# Altium project 主控A.PrjPCB
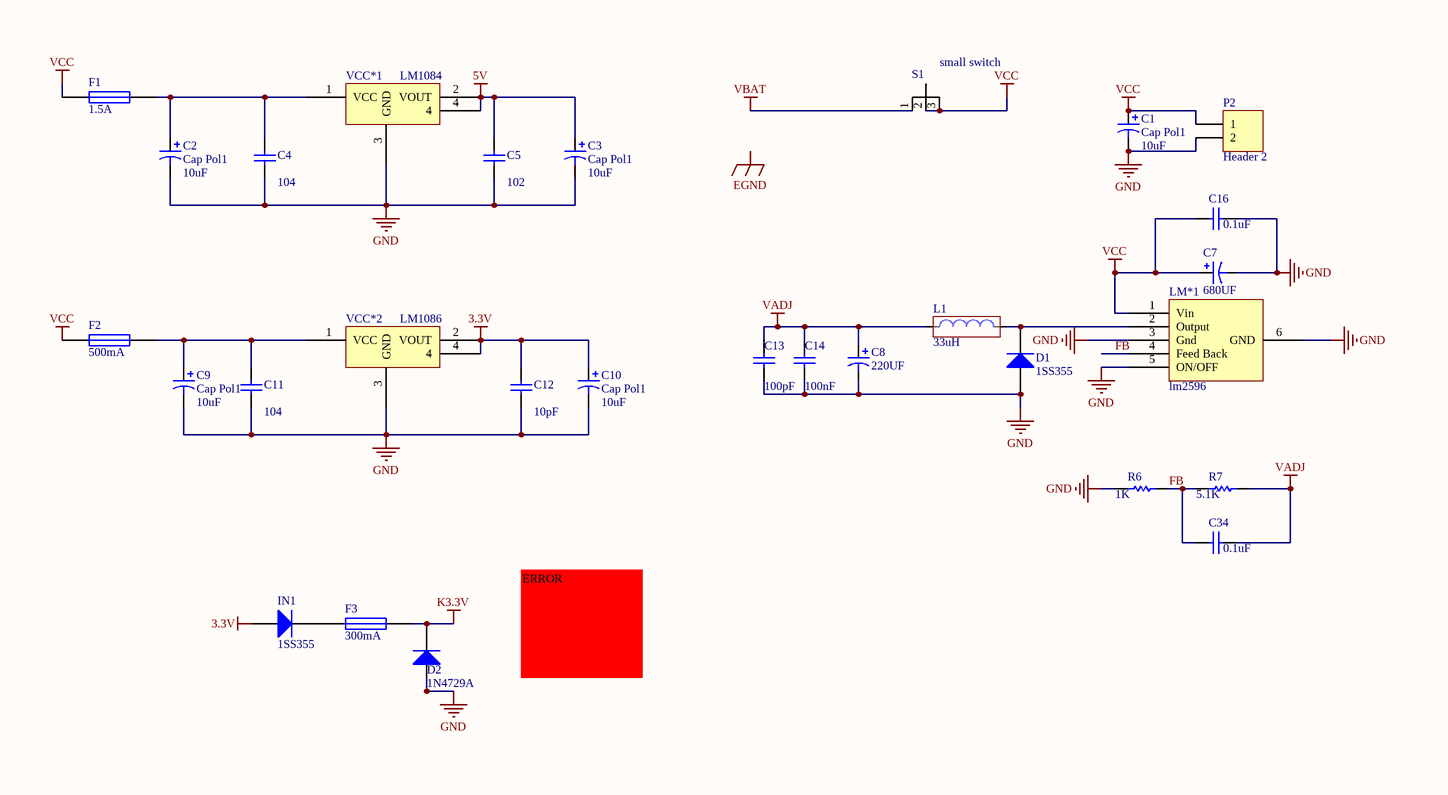
[diagram p0: 主控A.SchDoc, top left]
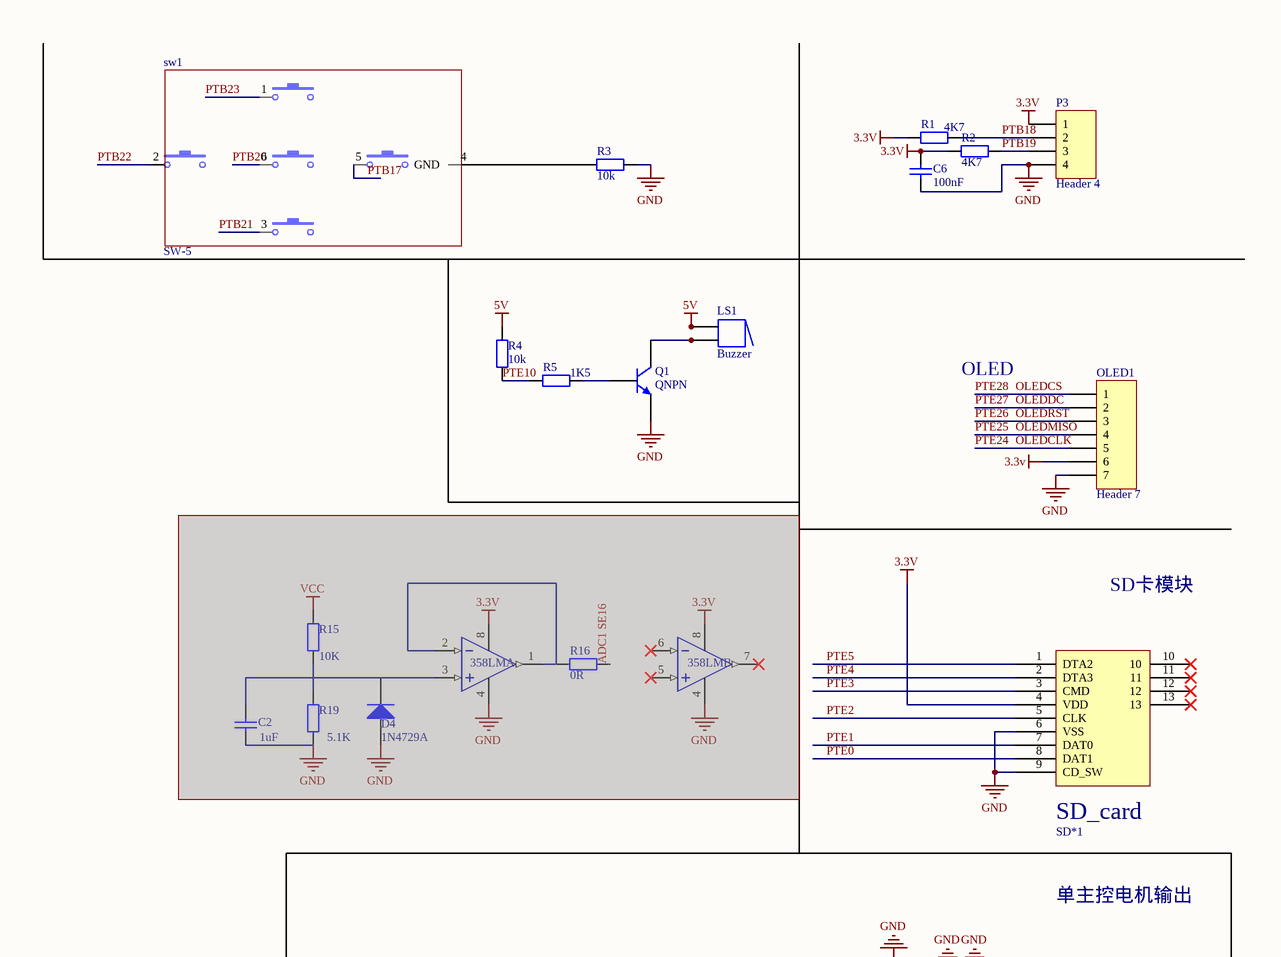
[diagram p1: 主控A.SchDoc, top right]
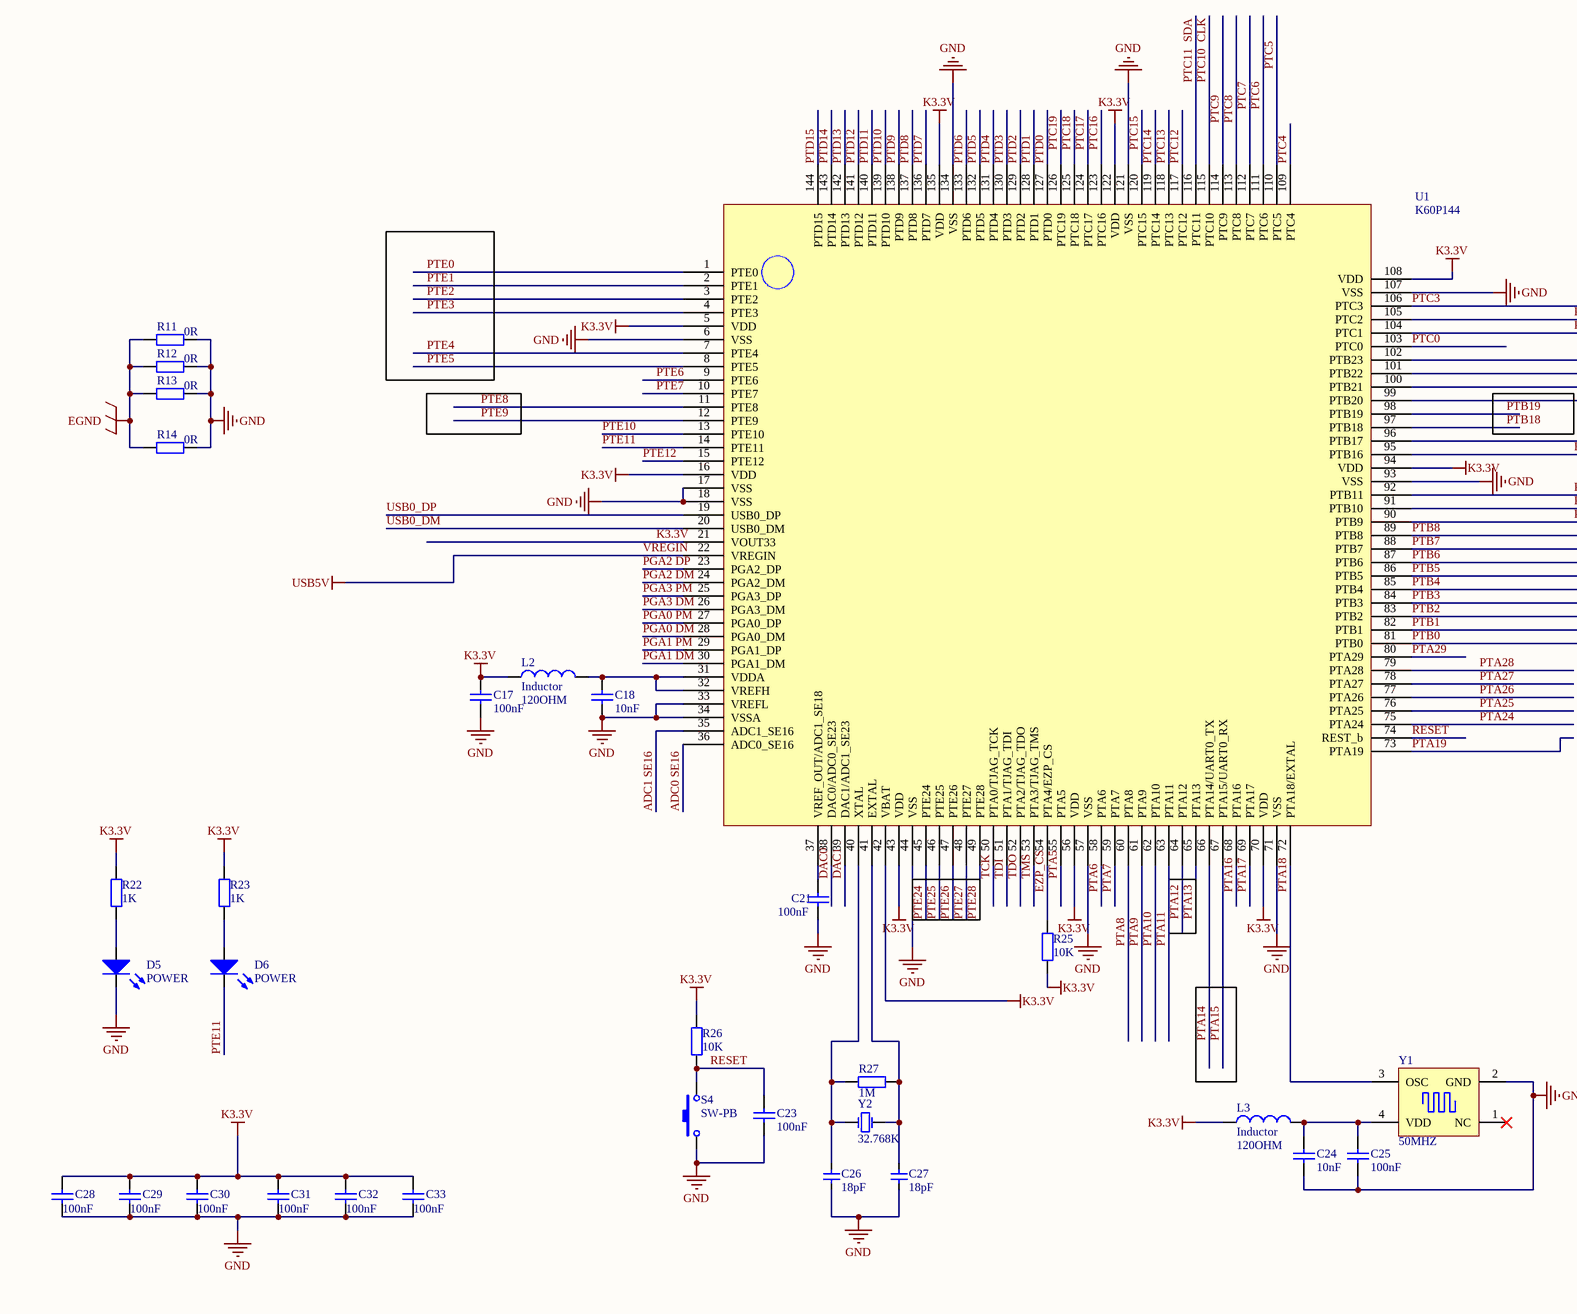
[diagram p2: 主控A.SchDoc, bottom left]
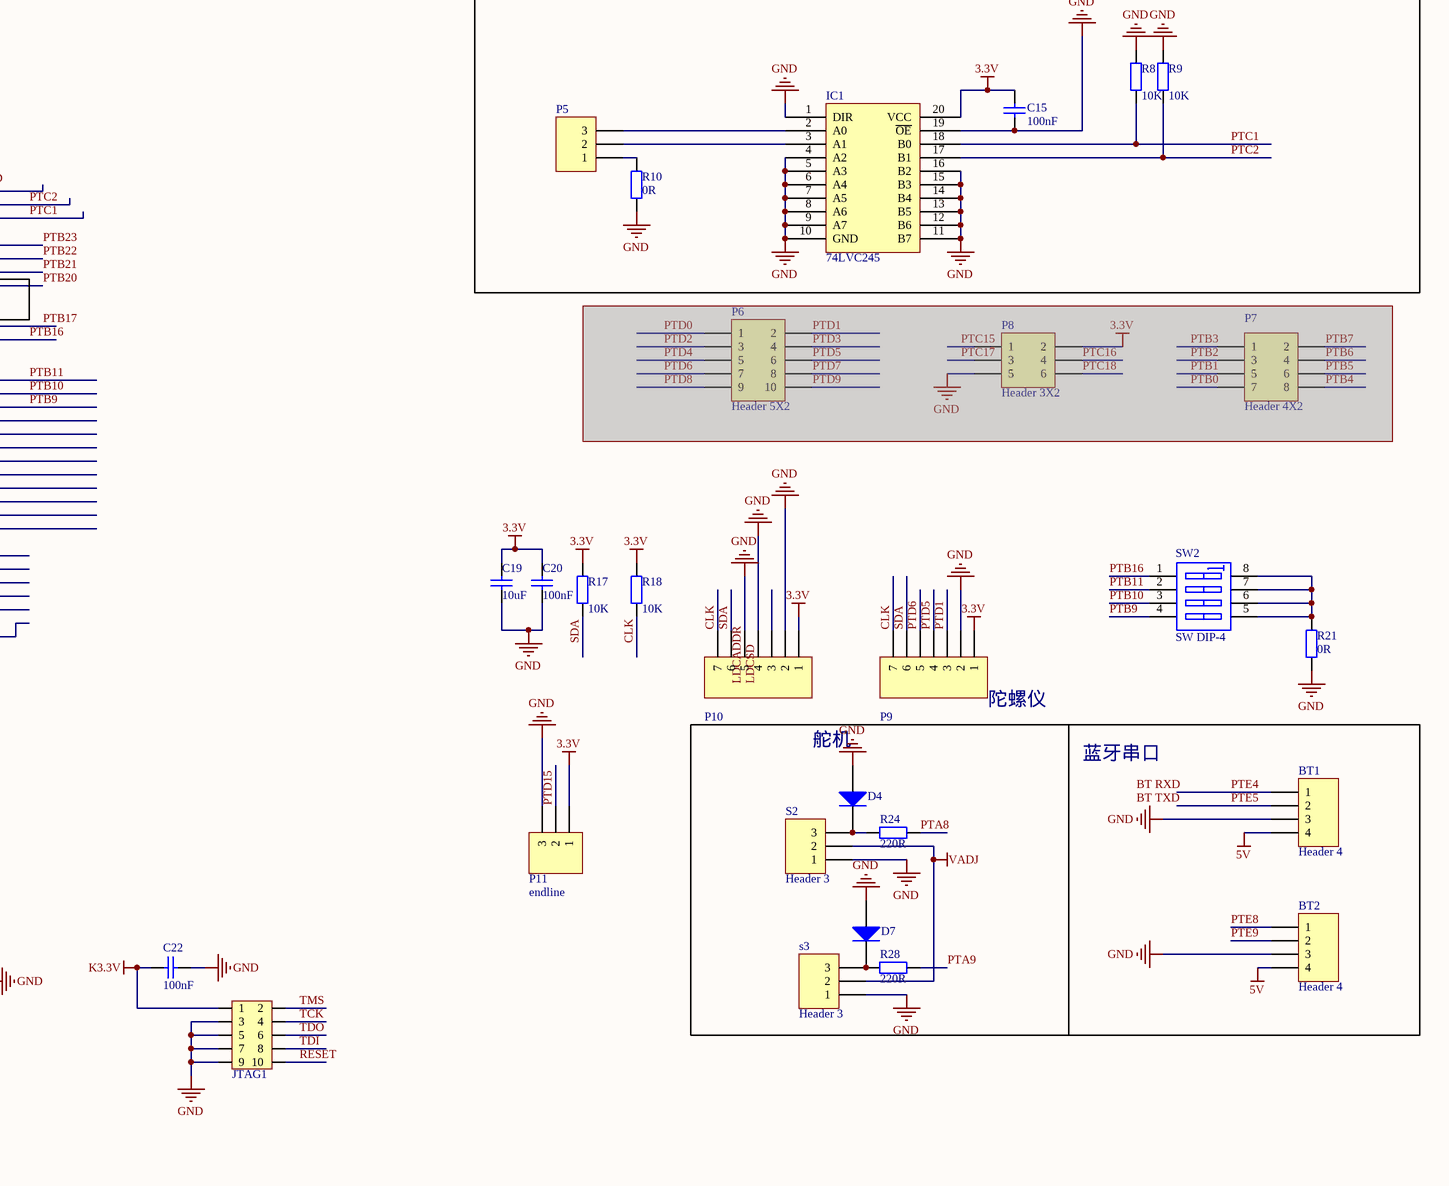
[diagram p3: 主控A.SchDoc, bottom right]
1 sheet, 106 parts. Net scope: global (net labels, ports and power ports of the same name join across sheets).
Board file: 主控A.PcbDoc

## Sheet 主控A.SchDoc
size A2

### Parts
(Parts that share a designator on the sheet are numbered #1, #2 ... from top to bottom, then left to right.)
358LM  LM358  [SO8_M]  (value not drawn)  (parts A,B of 2)  (masked out: inside a compile mask, not in the netlist)
BT1  Header 4  [HDR1X4]
BT2  Header 4  [HDR1X4]
C1  Cap Pol1  value 10uF  [SMD-EC-F8]
C2#1  Cap Pol1  value 10uF  [1206(2)]
C2#2  value 1uF  [C2012]  (hidden comment: Cap)  (masked out: inside a compile mask, not in the netlist)
C3  Cap Pol1  value 10uF  [1206(2)]
C4  value 104  [C2012]  (hidden comment: Cap)
C5  value 102  [C2012]  (hidden comment: Cap)
C6  100nF  [C2012]
C7  680UF  [c2012]
C8  220UF  [C2012]
C9  Cap Pol1  value 10uF  [1206(2)]
C10  Cap Pol1  value 10uF  [1206(2)]
C11  value 104  [C2012]  (hidden comment: Cap)
C12  value 10pF  [C2012]  (hidden comment: Cap)
C13  value 100pF  [C2012]  (hidden comment: Cap)
C14  value 100nF  [C2012]  (hidden comment: Cap)
C15  100nF  [C2012]
C16  value 0.1uF  [C2012]  (hidden comment: Cap)
C17  100nF  [C2012]
C18  10nF  [C2012]
C19  10uF  [C2012]
C20  100nF  [C2012]
C21  100nF  [c2012]
C22  100nF  [R2012]
C23  100nF  [C2012]
C24  10nF  [C2012]
C25  100nF  [C2012]
C26  18pF  [C2012]
C27  18pF  [C2012]
C28  value 100nF  [C2012]  (hidden comment: Cap)
C29  value 100nF  [C2012]  (hidden comment: Cap)
C30  value 100nF  [C2012]  (hidden comment: Cap)
C31  value 100nF  [C2012]  (hidden comment: Cap)
C32  value 100nF  [C2012]  (hidden comment: Cap)
C33  value 100nF  [C2012]  (hidden comment: Cap)
C34  value 0.1uF  [C2012]  (hidden comment: Cap)
D1  1SS355  [hole-chip diode]
D2  1N4729A  [hole-chip diode]
D4#1  1N4729A  [hole-chip diode]  (masked out: inside a compile mask, not in the netlist)
D4#2  1N4729A  [hole-chip diode]  (value not drawn)
D5  POWER  [R2012]
D6  POWER  [R2012]
D7  1N4729A  [hole-chip diode]  (value not drawn)
F1  1.5A  [1206(2)]
F2  500mA  [1206(2)]
F3  300mA  [1206(2)]
IC1  74LVC245  [74LVC245 TSSOP]
IN1  1SS355  [1206(2)]
JTAG1  Header 5X2  [IDC5X2]  (value not drawn)
L1  33uH  [SMD-EC-F5]
L2  Inductor  value 120OHM  [C2012]
L3  Inductor  value 120OHM  [C2012]
LM*1  lm2596  [lm2596]
LS1  Buzzer  [ABSM-1574]
OLED1  Header 7  [HDR1X7]
P2  Header 2  [HDR1X2]
P3  Header 4  [HDR1X4]
P5  Header 3  [HDR1X3]  (value not drawn)
P6  Header 5X2  [HDR2X5]  (masked out: inside a compile mask, not in the netlist)
P7  Header 4X2  [HDR2X4]  (masked out: inside a compile mask, not in the netlist)
P8  Header 3X2  [HDR2X3]  (masked out: inside a compile mask, not in the netlist)
P9  Header 7  [HDR1X7]  (value not drawn)
P10  Header 7  [HDR1X7]  (value not drawn)
P11  endline  [HDR1X3]
Q1  QNPN  [SOT23_N]
R1  value 4K7  [R2012]  (hidden comment: Res2)
R2  value 4K7  [R2012]  (hidden comment: Res2)
R3  10k  [R2012]
R4  10k  [R2012]
R5  value 1K5  [R2012]  (hidden comment: Res2)
R6  value 1K  [R2012]  (hidden comment: Res)
R7  value 5.1K  [R2012]  (hidden comment: Res)
R8  value 10K  [R2012]  (hidden comment: Res2)
R9  value 10K  [R2012]  (hidden comment: Res2)
R10  value 0R  [1206(2)]  (hidden comment: Res2)
R11  value 0R  [1206(2)]  (hidden comment: Res2)
R12  value 0R  [1206(2)]  (hidden comment: Res2)
R13  value 0R  [1206(2)]  (hidden comment: Res2)
R14  value 0R  [1206(2)]  (hidden comment: Res2)
R15  value 10K  [1206(2)]  (hidden comment: Res2)  (masked out: inside a compile mask, not in the netlist)
R16  value 0R  [1206(2)]  (hidden comment: Res2)  (masked out: inside a compile mask, not in the netlist)
R17  value 10K  [R2012]  (hidden comment: Res2)
R18  value 10K  [R2012]  (hidden comment: Res2)
R19  value 5.1K  [1206(2)]  (hidden comment: Res2)  (masked out: inside a compile mask, not in the netlist)
R21  value 0R  [1206(2)]  (hidden comment: Res2)
R22  1K  [R2012]
R23  1K  [R2012]
R24  220R  [R2012]
R25  10K  [R2012]
R26  10K  [R2012]
R27  1M  [R2012]
R28  220R  [R2012]
S1  small switch  [small switch]
S2  Header 3  [HDR1X3]
s3  Header 3  [HDR1X3]
S4  SW-PB  [SMT_Button]
SD*1  TF_card  [SD_card]  (value not drawn)
sw1  SW-5  [SW-5]
SW2  SW DIP-4  [switch_4to4]
U1  K60P144  [LQFP144]
VCC*1  LM1084  [DPAK LM2940]
VCC*2  LM1086  [DPAK LM2940]
Y1  50MHZ  [贴片有源晶体]
Y2  32.768K  [CT3215]

### Blocks framed on the sheet
单主控电机输出: C15 IC1 P5 R8-R10

### Nets
3.3V: C6.2 C10.1 C12.2 C15.1 C19.2 C20.2 IC1.20(VCC) IN1.1(A) OLED1.6 P3.1 P9.1 P10.1 P11.1 R1.1 R2.2 R17.2 R18.2 SD*1.4(VDD) VCC*2.2(VOUT) VCC*2.4
5V: BT1.4 BT2.4 C3.1 C5.2 LS1.1 LS1.1A R4.1 VCC*1.2(VOUT) VCC*1.4
EGND: R11.2 R12.2 R13.2 R14.2
GND: BT1.3 BT2.3 C1.2 C2#1.2 C3.2 C4.1 C5.1 C6.1 C7.2 C8.2 C9.2 C10.2 C11.1 C12.1 C13.1 C14.1 C15.2 C16.1 C17.1 C18.1 C19.1 C20.1 C21.1 C22.2 C23.1 C24.1 C25.1 C26.1 C27.1 C28.1 C29.1 C30.1 C31.1 C32.1 C33.1 D1.1(A) D2.1(A) D4#2.1(A) D5.2 D7.1(A) IC1.1(DIR) IC1.4(A2) IC1.5(A3) IC1.6(A4) IC1.7(A5) IC1.8(A6) IC1.9(A7) IC1.10(GND) IC1.11(B7) IC1.12(B6) IC1.13(B5) IC1.14(B4) IC1.15(B3) IC1.16(B2) IC1.19(~{OE}) JTAG1.3 JTAG1.5 JTAG1.7 JTAG1.9 LM*1.3(Gnd) LM*1.5(ON/OFF) LM*1.6(GND) OLED1.7 P2.2 P3.4 P9.2 P10.2 P10.4 P10.5 P11.3 Q1.3(E) R3.1 R6.2 R8.2 R9.2 R10.2 R11.1 R12.1 R13.1 R14.1 R21.1 S2.1 s3.1 S4.1 SD*1.6(VSS) SD*1.9(CD_SW) U1.6(VSS) U1.17(VSS) U1.18(VSS) U1.33(VREFL) U1.34(VSSA) U1.44(VSS) U1.57(VSS) U1.71(VSS) U1.93(VSS) U1.107(VSS) U1.121(VSS) U1.134(VSS) VCC*1.3(GND) VCC*2.3(GND) Y1.2(GND)
K3.3V: C17.2 C22.1 C28.2 C29.2 C30.2 C31.2 C32.2 C33.2 D2.2(K) F3.1 JTAG1.1 L2.1 L3.1 R22.2 R23.2 R25.1 R26.2 U1.5(VDD) U1.16(VDD) U1.21(VOUT33) U1.42(VBAT) U1.43(VDD) U1.56(VDD) U1.70(VDD) U1.94(VDD) U1.108(VDD) U1.122(VDD) U1.135(VDD)
VADJ: C8.1 C13.2 C14.2 C34.1 L1.1 R7.1 S2.2 s3.2
VBAT: S1.1
VCC: C1.1 C7.1 C16.2 F1.1 F2.1 LM*1.1(Vin) P2.1 S1.2 S1.3
VREGIN: U1.22(VREGIN)  [also labelled USB5V]
ADC0 SE16: U1.36(ADC0_SE16)
ADC1 SE16: U1.35(ADC1_SE16)
CLK: P9.7 P10.7 R18.1 U1.115(PTC10)  [also labelled PTC10]
DAC0: U1.38(DAC0/ADC0_SE23)
DAC1: U1.39(DAC1/ADC1_SE23)
EZP_CS: R25.2 U1.54(PTA4/EZP_CS)
FB: C34.2 LM*1.4(Feed_Back) R6.1 R7.2
OLEDCLK: OLED1.5 U1.45(PTE24)  [also labelled PTE24]
OLEDCS: OLED1.1 U1.49(PTE28)  [also labelled PTE28]
OLEDDC: OLED1.2 U1.48(PTE27)  [also labelled PTE27]
OLEDMISO: OLED1.4 U1.46(PTE25)  [also labelled PTE25]
OLEDRST: OLED1.3 U1.47(PTE26)  [also labelled PTE26]
PGA0 DM: U1.28(PGA0_DM)
PGA0 PM: U1.27(PGA0_DP)
PGA1 DM: U1.30(PGA1_DM)
PGA1 PM: U1.29(PGA1_DP)
PGA2 DM: U1.24(PGA2_DM)
PGA2 DP: U1.23(PGA2_DP)
PGA3 DM: U1.26(PGA3_DM)
PGA3 PM: U1.25(PGA3_DP)
PTA5: U1.55(PTA5)
PTA6: U1.58(PTA6)
PTA7: U1.59(PTA7)
PTA8: R24.2 U1.60(PTA8)
PTA9: R28.2 U1.61(PTA9)
PTA10: U1.62(PTA10)
PTA11: U1.63(PTA11)
PTA12: U1.64(PTA12)
PTA13: U1.65(PTA13)
PTA14: U1.66(PTA14/UART0_TX)
PTA15: U1.67(PTA15/UART0_RX)
PTA16: U1.68(PTA16)
PTA17: U1.69(PTA17)
PTA18: U1.72(PTA18/EXTAL) Y1.3(OSC)
PTA19: U1.73(PTA19)
PTA24: U1.75(PTA24)
PTA25: U1.76(PTA25)
PTA26: U1.77(PTA26)
PTA27: U1.78(PTA27)
PTA28: U1.79(PTA28)
PTA29: U1.80(PTA29)
PTB0: U1.81(PTB0)
PTB1: U1.82(PTB1)
PTB2: U1.83(PTB2)
PTB3: U1.84(PTB3)
PTB4: U1.85(PTB4)
PTB5: U1.86(PTB5)
PTB6: U1.87(PTB6)
PTB7: U1.88(PTB7)
PTB8: U1.89(PTB8)
PTB9: SW2.4(A4) U1.90(PTB9)
PTB10: SW2.3(A3) U1.91(PTB10)
PTB11: SW2.2(A2) U1.92(PTB11)
PTB16: SW2.1(A1) U1.95(PTB16)
PTB17: sw1.5 U1.96(PTB17)
PTB18: P3.2 R1.2 U1.97(PTB18)
PTB19: P3.3 R2.1 U1.98(PTB19)
PTB20: sw1.6 U1.99(PTB20)
PTB21: sw1.3 U1.100(PTB21)
PTB22: sw1.2 U1.101(PTB22)
PTB23: sw1.1 U1.102(PTB23)
PTC0: U1.103(PTC0)
PTC1: IC1.18(B0) R8.1 U1.104(PTC1)
PTC2: IC1.17(B1) R9.1 U1.105(PTC2)
PTC3: U1.106(PTC3)
PTC4: U1.109(PTC4)
PTC5: U1.110(PTC5)
PTC6: U1.111(PTC6)
PTC7: U1.112(PTC7)
PTC8: U1.113(PTC8)
PTC9: U1.114(PTC9)
PTC11: P9.6 P10.6 R17.1 U1.116(PTC11)  [also labelled SDA]
PTC12: U1.117(PTC12)
PTC13: U1.118(PTC13)
PTC14: U1.119(PTC14)
PTC15: U1.120(PTC15)
PTC16: U1.123(PTC16)
PTC17: U1.124(PTC17)
PTC18: U1.125(PTC18)
PTC19: U1.126(PTC19)
PTD0: U1.127(PTD0)
PTD1: P9.3 U1.128(PTD1)
PTD2: U1.129(PTD2)
PTD3: U1.130(PTD3)
PTD4: U1.131(PTD4)
PTD5: P9.4 U1.132(PTD5)
PTD6: P9.5 U1.133(PTD6)
PTD7: U1.136(PTD7)
PTD8: U1.137(PTD8)
PTD9: U1.138(PTD9)
PTD10: U1.139(PTD10)
PTD11: U1.140(PTD11)
PTD12: U1.141(PTD12)
PTD13: U1.142(PTD13)
PTD14: U1.143(PTD14)
PTD15: P11.2 U1.144(PTD15)
PTE0: SD*1.8(DAT1) U1.1(PTE0)
PTE1: SD*1.7(DAT0) U1.2(PTE1)
PTE2: SD*1.5(CLK) U1.3(PTE2)
PTE3: SD*1.3(CMD) U1.4(PTE3)
PTE4: BT1.1 SD*1.2(DTA3) U1.7(PTE4)
PTE5: BT1.2 SD*1.1(DTA2) U1.8(PTE5)
PTE6: U1.9(PTE6)
PTE7: U1.10(PTE7)
PTE8: BT2.1 U1.11(PTE8)
PTE9: BT2.2 U1.12(PTE9)
PTE10: R4.2 R5.2 U1.13(PTE10)
PTE11: D6.2 U1.14(PTE11)
PTE12: U1.15(PTE12)
RESET: C23.2 JTAG1.10 R26.1 S4.2 U1.74(REST_b)
TCK: JTAG1.4 U1.50(PTA0/TJAG_TCK)
TDI: JTAG1.8 U1.51(PTA1/TJAG_TDI)
TDO: JTAG1.6 U1.52(PTA2/TJAG_TDO)
TMS: JTAG1.2 U1.53(PTA3/TJAG_TMS)
USB0_DM: U1.20(USB0_DM)
USB0_DP: U1.19(USB0_DP)
NetC2#1_1: C2#1.1 C4.2 F1.2 VCC*1.1(VCC)
NetC9_1: C9.1 C11.2 F2.2 VCC*2.1(VCC)
NetC18_2: C18.2 L2.2 U1.31(VDDA) U1.32(VREFH)
NetC21_2: C21.2 U1.37(VREF_OUT/ADC1_SE18)
NetC24_2: C24.2 C25.2 L3.2 Y1.4(VDD)
NetC26_2: C26.2 R27.1 U1.40(XTAL) Y2.1(OSC1)
NetC27_2: C27.2 R27.2 U1.41(EXTAL) Y2.2(OSC2)
NetD1_2: D1.2(K) L1.2 LM*1.2(Output)
NetD4#2_2: D4#2.2(K) R24.1 S2.3
NetD5_1: D5.1 R22.1
NetD6_1: D6.1 R23.1
NetD7_2: D7.2(K) R28.1 s3.3
NetF3_2: F3.2 IN1.2(K)
NetIC1_2: IC1.2(A0) P5.3
NetIC1_3: IC1.3(A1) P5.2
NetLS1_2: LS1.2 LS1.2A Q1.1(C)
NetP5_1: P5.1 R10.1
NetQ1_2: Q1.2(B) R5.1
NetR3_2: R3.2 sw1.4(GND)
NetR21_2: R21.2 SW2.5(B4) SW2.6(B3) SW2.7(B2) SW2.8(B1)

Not connected (* = marked no-connect by the designer): P10 3; SD*1 10* 11* 12* 13*; Y1 1(NC)*

### Notes on the sheet
- OLED
- SD卡模块
- ERROR
- (near D4#2) 舵机
- (near P9) 陀螺仪
- 蓝牙串口
- Labels drawn without touching a wire or pin: BT RXD, BT TXD, EGND, LDCADDR, LDCSD
- (in symbol TF_card) SD_card

### Library data of the parts
BT1 BT2 P3 = Header 4: Header, 4-Pin; LatestRevisionDate: 17-Jul-2002; LatestRevisionNote: Re-released for DXP Platform.; Publisher: Altium Limited
C1 C2#1 C3 C9 C10 = Cap Pol1: Polarized Capacitor (Radial); Published: 8-Jun-2000; LatestRevisionDate: 17-Jul-2002; LatestRevisionNote: Re-released for DXP Platform.; PackageReference: RB7.6-15; Publisher: Altium Limited; PackageDescription: Polarized Capacitor (Radial); 2 Leads
C2#2 C4 C5 C11 C12 C28-C33 = Cap: 贴片电容; Published: 8-Jun-2000; LatestRevisionDate: 17-Jul-2002; LatestRevisionNote: Re-released for DXP Platform.; PackageReference: RAD-0.3; Publisher: Altium Limited
C6 C13-C25 C34 = Cap: Capacitor
  C13 C14 C16 C34: Published: 8-Jun-2000; LatestRevisionDate: 17-Jul-2002; LatestRevisionNote: Re-released for DXP Platform.; PackageReference: RAD-0.3; Publisher: Altium Limited; PackageDescription: Radial Cap, Thru-Hole; 2 Leads; 0.3 in Pin Spacing
C7 C8 = CAP+
C26 C27 = 陶瓷电容: CAP
D1 D2 D4#1 D4#2 D7 IN1 = Diode 1N4148: High Conductance Fast Diode; LatestRevisionDate: 17-Jul-2002; LatestRevisionNote: Re-released for DXP Platform.; DatasheetDocument: 1997; PackageReference: DO-35; Publisher: Altium Limited; Code_JEDEC: DO-204-AH; ComponentLink1Description: Manufacturer Link; ComponentLink2Description: Datasheet; ComponentLink2URL: http://www.fairchildsemi.com/ds/1N%2F1N4148.pdf
D5 D6 = LED: Typical INFRARED GaAs LED
F1-F3 = Fuse 1: Fuse; Published: 8-Jun-2000; LatestRevisionDate: 17-Jul-2002; LatestRevisionNote: Re-released for DXP Platform.; PackageReference: PIN-W2/E2.8; Publisher: Altium Limited
JTAG1 P6 = Header 5X2: Header, 5-Pin, Dual row
  P6: LatestRevisionDate: 17-Jul-2002; LatestRevisionNote: Re-released for DXP Platform.; Publisher: Altium Limited
L1 = Inductor
L2 L3 = Inductor: Code_IEC: 1005; Published: 8-Jun-2000; LatestRevisionDate: 29-May-2009; LatestRevisionNote: IPC-7351 Footprint Added.; PackageReference: 0402-A; Publisher: Altium Limited; PackageDescription: Chip Inductor; Code_JEITA: 0402
LS1 = Buzzer: Magnetic Transducer Buzzer; pin to pad: 1>1A 2>2A; Published: 24-Mar-1999; LatestRevisionDate: 17-Dec-2003; LatestRevisionNote: Schematic revised, PCB Footprint replaced.; DatasheetVersion: 17-Dec-2003; PackageReference: ABSM-1574; Publisher: Altium Limited; ComponentLink1Description: Manufacturer Link; ComponentLink1URL: http://www.megastar.com/linecard/buzzmode/index.php
OLED1 P9 P10 = Header 7: Header, 7-Pin; LatestRevisionDate: 17-Jul-2002; LatestRevisionNote: Re-released for DXP Platform.; Publisher: Altium Limited
P2 = Header 2: Header, 2-Pin; LatestRevisionDate: 17-Jul-2002; LatestRevisionNote: Re-released for DXP Platform.; Publisher: Altium Limited
P5 P11 S2 s3 = Header 3: Header, 3-Pin; LatestRevisionDate: 17-Jul-2002; LatestRevisionNote: Re-released for DXP Platform.; Publisher: Altium Limited
P7 = Header 4X2: Header, 4-Pin, Dual row; LatestRevisionDate: 17-Jul-2002; LatestRevisionNote: Re-released for DXP Platform.; Publisher: Altium Limited
P8 = Header 3X2: Header, 3-Pin, Dual row; LatestRevisionDate: 17-Jul-2002; LatestRevisionNote: Re-released for DXP Platform.; Publisher: Altium Limited
Q1 = QNPN: NPN Bipolar Transistor; pin to pad: 2>3 3>2; Published: 8-Jun-2000; LatestRevisionDate: 29-May-2009; LatestRevisionNote: IPC-7351 Footprint Added.; PackageVersion: Aug-1999; PackageReference: SOT-23B; Publisher: Altium Limited; PackageDescription: 3-Pin SOT-23 Package 0.95 mm Pitch, 2.4 mm Lead Span
R1 R2 R5 R8-R19 R21 = Res2: Resistor; Published: 8-Jun-2000; LatestRevisionDate: 17-Jul-2002; LatestRevisionNote: Re-released for DXP Platform.; PackageReference: AXIAL-0.4; Publisher: Altium Limited; PackageDescription: Axial Device, Thru-Hole; 2 Leads; 0.4 in Pin Spacing
R3 R4 = Res: Resistor of led
R6 R7 = Res: 贴片电阻; Published: 8-Jun-2000; LatestRevisionDate: 17-Jul-2002; LatestRevisionNote: Re-released for DXP Platform.; PackageReference: AXIAL-0.3; Publisher: Altium Limited
R22-R28 = Res: Resistor
S4 = SW-PB: Switch
SW2 = SW DIP-4: DIP Switch, 4 Position, SPST; Published: 24-Mar-1999; LatestRevisionDate: 29-May-2009; LatestRevisionNote: IPC-7351 Footprint Added.; PackageVersion: Dec-2002; PackageReference: SO8; Publisher: Altium Limited; PackageDescription: 8-Pin Small Outline Integrated Circuit 1.27 mm Pitch; Code_JEDEC: MS-012-AA; Code_IPC: SOIC127P600-8
VCC*1 VCC*2 = LM1086: pin to pad: 1>3 3>1
Y1 = XTAL1
Y2 = XTAL: Crystal Oscillator